# EAGLE schematic Automaton_no_switches (EAGLE 6.1)
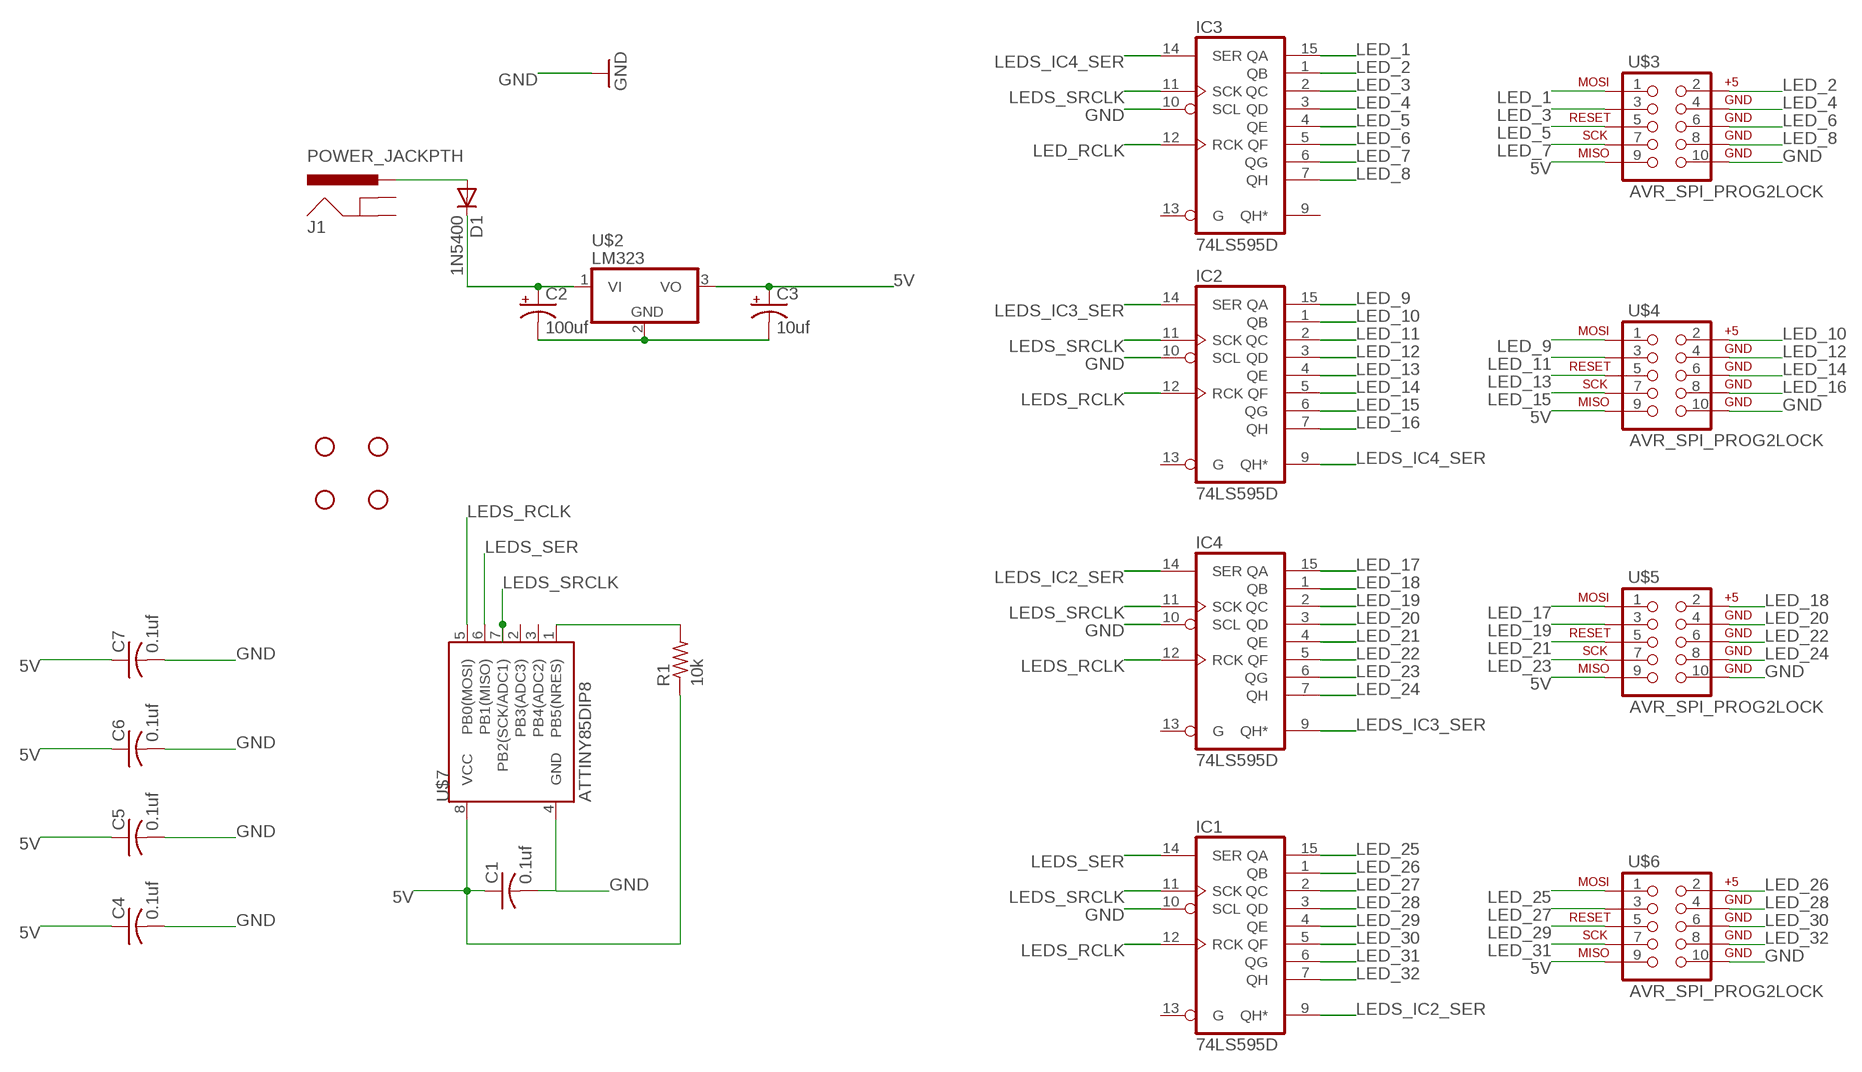
[diagram p0: schematic, sheet 1]

## Parts
C1  0.1uf  C-US025-024X044  [C025-024X044]
C2  100uf  CPOL-USE5-10.5  [E5-10,5]
C3  10uf  CPOL-USE2-5  [E2-5]
C4  0.1uf  C-US025-024X044  [C025-024X044]
C5  0.1uf  C-US025-024X044  [C025-024X044]
C6  0.1uf  C-US025-024X044  [C025-024X044]
C7  0.1uf  C-US025-024X044  [C025-024X044]
D1  1N5400  [DO201-15]
IC1  74LS595D  [SO16]
IC2  74LS595D  [SO16]
IC3  74LS595D  [SO16]
IC4  74LS595D  [SO16]
J1  POWER_JACKPTH  [POWER_JACK_PTH]
JP1  STAND-OFF  [STAND-OFF]
JP2  STAND-OFF  [STAND-OFF]
JP3  STAND-OFF  [STAND-OFF]
JP4  STAND-OFF  [STAND-OFF]
R1  10k  R-US_M1206  [M1206]
U$2  LM323  [TO220H]
U$3  AVR_SPI_PROG2LOCK  [2X5-SHROUDED_LOCK]
U$4  AVR_SPI_PROG2LOCK  [2X5-SHROUDED_LOCK]
U$5  AVR_SPI_PROG2LOCK  [2X5-SHROUDED_LOCK]
U$6  AVR_SPI_PROG2LOCK  [2X5-SHROUDED_LOCK]
U$7  ATTINY85DIP8  [DIP08]

## Nets
5V: C1.1 C3.+ C4.1 C5.1 C6.1 C7.1 R1.1 U$2.3(VO) U$3.9 U$4.9 U$5.9 U$6.9 U$7.8(VCC)
GND: C1.2 C4.2 C5.2 C6.2 C7.2 IC1.10(SCL) IC2.10(SCL) IC3.10(SCL) IC4.10(SCL) U$3.10 U$4.10 U$5.10 U$6.10 U$7.4(GND)
LED_1: IC3.15(QA) U$3.1
LED_2: IC3.1(QB) U$3.2
LED_3: IC3.2(QC) U$3.3
LED_4: IC3.3(QD) U$3.4
LED_5: IC3.4(QE) U$3.5
LED_6: IC3.5(QF) U$3.6
LED_7: IC3.6(QG) U$3.7
LED_8: IC3.7(QH) U$3.8
LED_9: IC2.15(QA) U$4.1
LED_10: IC2.1(QB) U$4.2
LED_11: IC2.2(QC) U$4.3
LED_12: IC2.3(QD) U$4.4
LED_13: IC2.4(QE) U$4.5
LED_14: IC2.5(QF) U$4.6
LED_15: IC2.6(QG) U$4.7
LED_16: IC2.7(QH) U$4.8
LED_17: IC4.15(QA) U$5.1
LED_18: IC4.1(QB) U$5.2
LED_19: IC4.2(QC) U$5.3
LED_20: IC4.3(QD) U$5.4
LED_21: IC4.4(QE) U$5.5
LED_22: IC4.5(QF) U$5.6
LED_23: IC4.6(QG) U$5.7
LED_24: IC4.7(QH) U$5.8
LED_25: IC1.15(QA) U$6.1
LED_26: IC1.1(QB) U$6.2
LED_27: IC1.2(QC) U$6.3
LED_28: IC1.3(QD) U$6.4
LED_29: IC1.4(QE) U$6.5
LED_30: IC1.5(QF) U$6.6
LED_31: IC1.6(QG) U$6.7
LED_32: IC1.7(QH) U$6.8
LED_RCLK: IC3.12(RCK)
LEDS_IC2_SER: IC1.9(QH*) IC4.14(SER)
LEDS_IC3_SER: IC2.14(SER) IC4.9(QH*)
LEDS_IC4_SER: IC2.9(QH*) IC3.14(SER)
LEDS_RCLK: IC1.12(RCK) IC2.12(RCK) IC4.12(RCK) U$7.5(PB0(MOSI))
LEDS_SER: IC1.14(SER) U$7.6(PB1(MISO))
LEDS_SRCLK: IC1.11(SCK) IC2.11(SCK) IC3.11(SCK) IC4.11(SCK) U$7.7(PB2(SCK/ADC1))
N$1: C2.+ D1.C U$2.1(VI)
N$2: R1.2 U$7.1(PB5(NRES))
N$3: D1.A J1.PWR
N$4: C2.- C3.- U$2.2(GND)
Unconnected: IC1.13(G) IC2.13(G) IC3.9(QH*) IC3.13(G) IC4.13(G) J1.GND J1.GNDBREAK U$7.2(PB3(ADC3)) U$7.3(PB4(ADC2))

## Power pins joined to a net without a drawn wire
GND: IC1.8(GND) IC2.8(GND) IC3.8(GND) IC4.8(GND)
VCC: IC1.16(VCC) IC2.16(VCC) IC3.16(VCC) IC4.16(VCC)

## Library data of the parts
C1 C4-C7 = resistor:C-US: CAPACITOR, American symbol
C2 C3 = rcl:CPOL-US: POLARIZED CAPACITOR, American symbol
D1 = diode:1N5400: DIODE standard rectifier, 3 A, 50 V (Motorola)
IC1-IC4 = 74xx-us:74*595: 8-bit SHIFT REGISTER, output latch
J1 = SparkFun:POWER_JACK: Power Jack This is the standard 5.5mm barrel jack for power. The PTH is the most common, proven, reliable, footprint. All others are experimental. The Slot footprint only works if the mill layer is transmitted to the PCB fab house so be warned. Spark Fun Electronics SKU : PRT-00119. Mating wall wart : TOL-00298 (and others)
JP1-JP4 = SparkFun-Electromechanical:STAND-OFF: #4 Stand Off This is the mechanical footprint for a #4 phillips button head screw. Use the keepout ring to avoid running the screw head into surrounding components. SKU : PRT-00447
R1 = resistor:R-US_: RESISTOR, American symbol
U$2 = MyLib:LM323
U$3-U$6 = SparkFun:AVR_SPI_PROG2: AVR ICSP Header This is the standard AVR In Circuit Serial Programming header. Minimal, but includes pin one indicator. Works with standard Olimex programmers. Also look for the 6-pin reduced version. Spark Fun Electronics SKU: PRT-00778
U$7 = *Personal Library:ATTINY85: Atmel 8-pin 2/4/8kB flash uC